# Altium project Main IF Board 5.PrjPcb
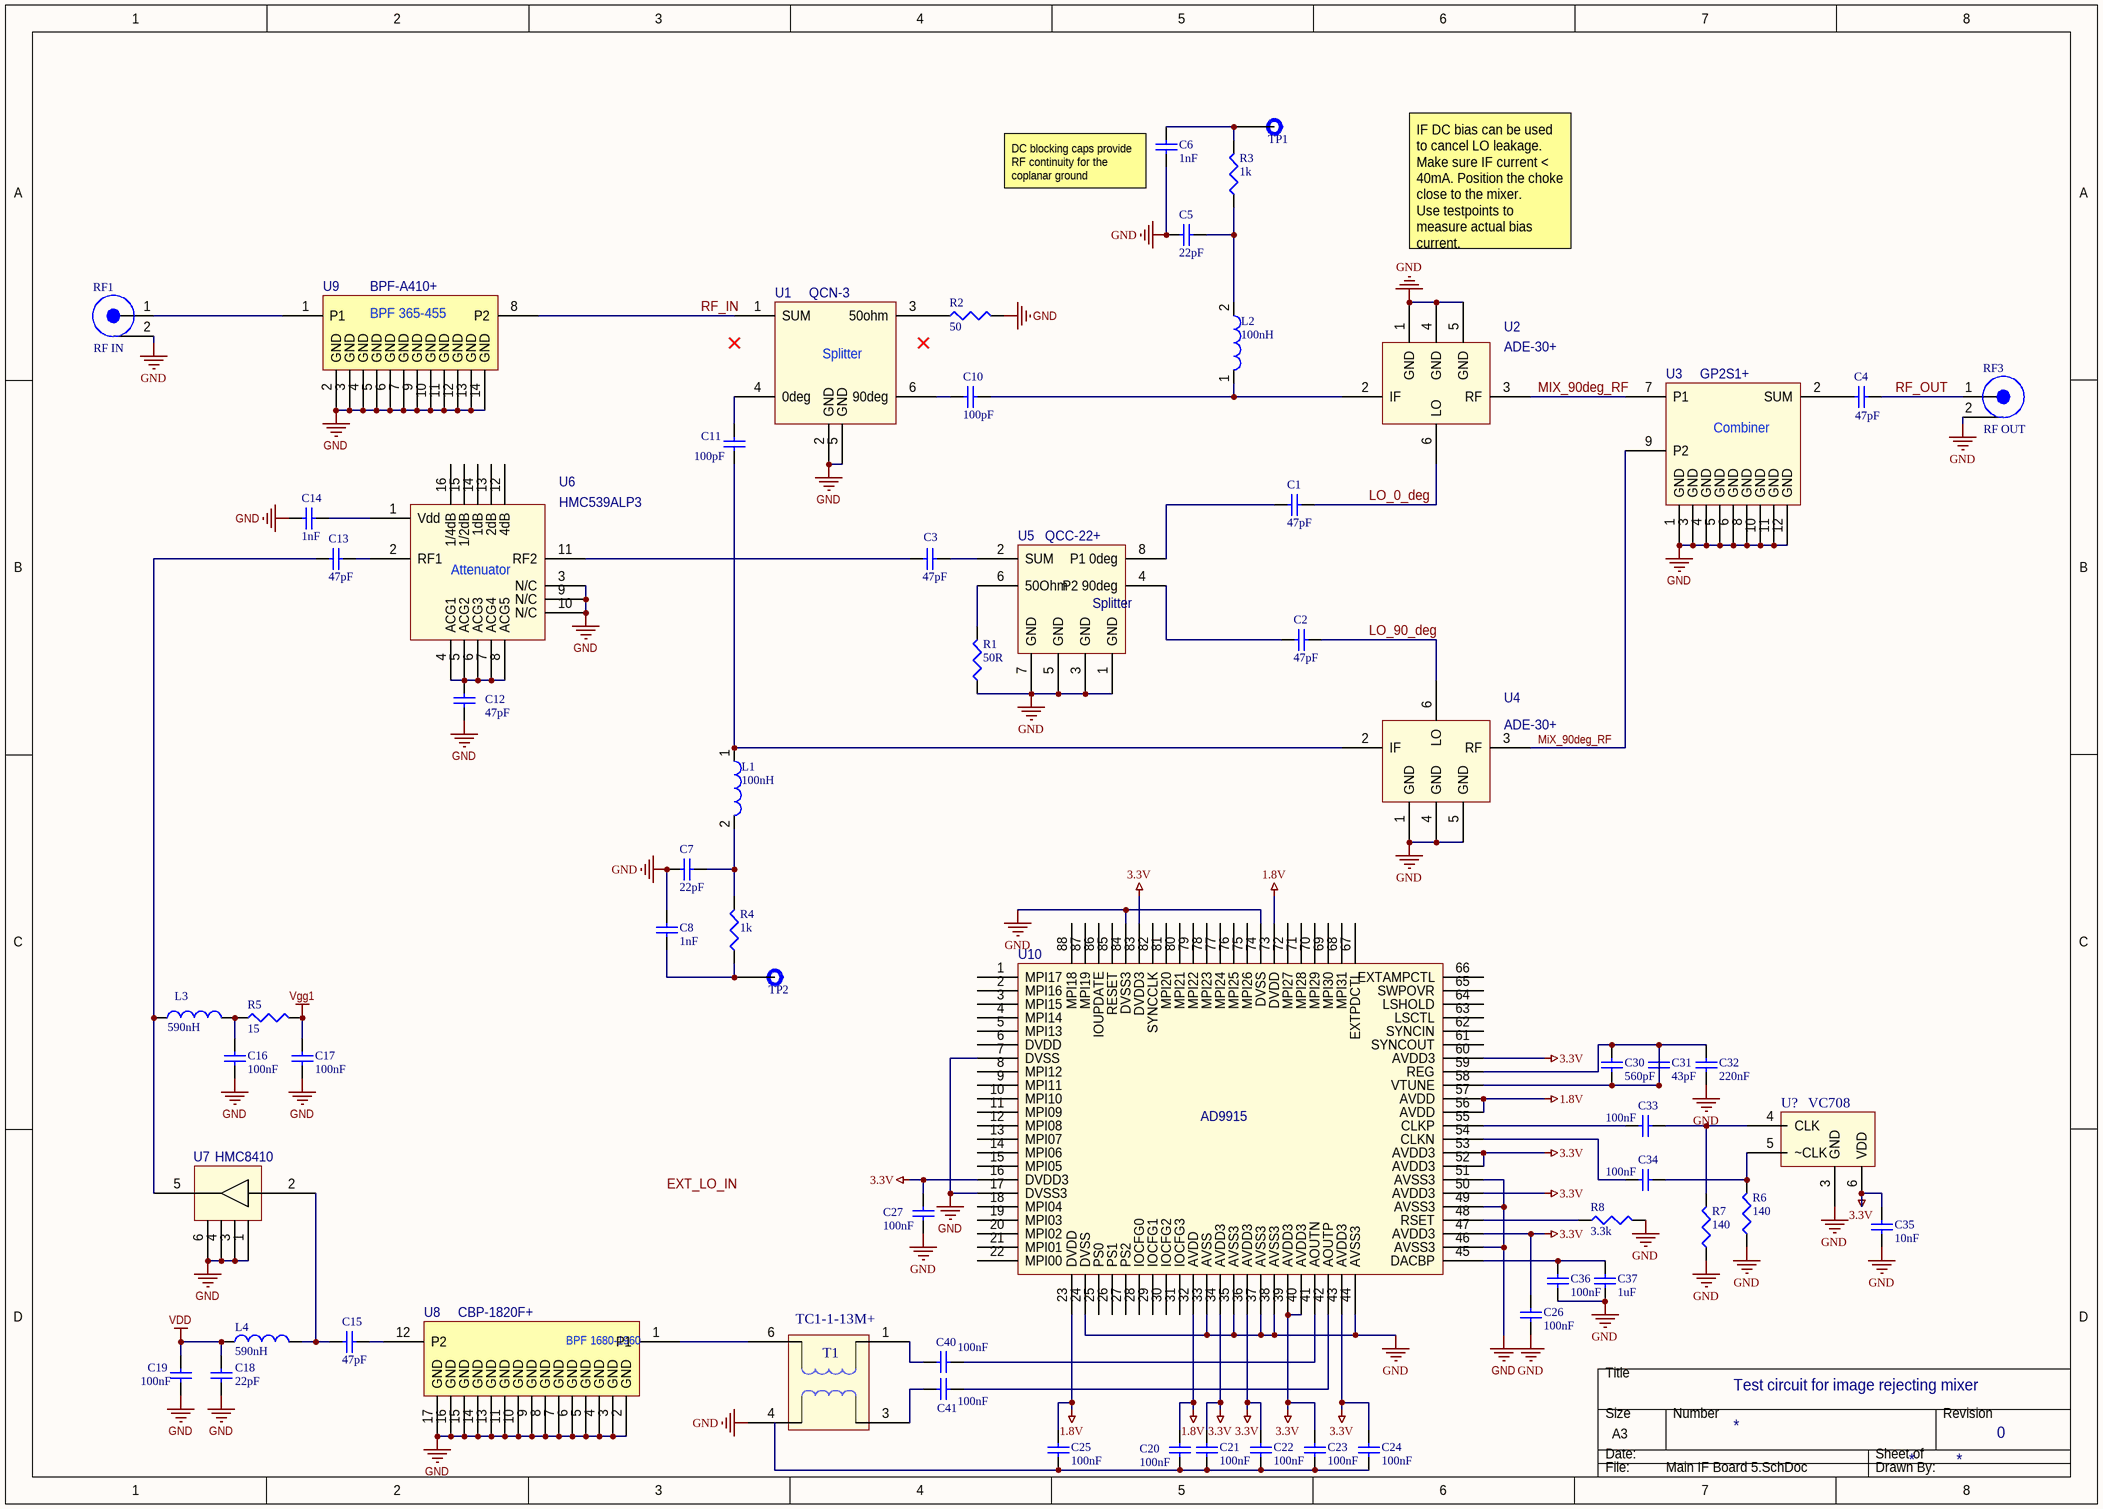
[diagram p0: Main IF Board 5.SchDoc]
1 sheet, 64 parts. Net scope: global (net labels, ports and power ports of the same name join across sheets).

## Sheet Main IF Board 5.SchDoc: Test circuit for image rejecting mixer
size A3; Revision: 0

### Parts
C1  value 47pF  [CAP0402]  (hidden comment: ATC520L103KT16T)
C2  value 47pF  [CAP0402]  (hidden comment: ATC520L103KT16T)
C3  value 47pF  [CAP0402]  (hidden comment: ATC520L103KT16T)
C4  value 47pF  [CAP0402]  (hidden comment: ATC520L103KT16T)
C5  value 22pF  [CAP0402]  (hidden comment: Capacitor)
C6  value 1nF  [CAP0603]  (hidden comment: Capacitor)
C7  value 22pF  [CAP0402]  (hidden comment: Capacitor)
C8  value 1nF  [CAP0603]  (hidden comment: Capacitor)
C10  value 100pF  [CAP0402]  (hidden comment: Capacitor)
C11  value 100pF  [CAP0402]  (hidden comment: Capacitor)
C12  value 47pF  [CAP0402]  (hidden comment: Capacitor)
C13  value 47pF  [CAP0402]  (hidden comment: Capacitor)
C14  value 1nF  [CAP0402]  (hidden comment: Capacitor)
C15  value 47pF  [CAP0402]  (hidden comment: Capacitor)
C16  value 100nF  [CAP0402]  (hidden comment: Capacitor)
C17  value 100nF  [CAP0402]  (hidden comment: Capacitor)
C18  value 22pF  [CAP0402]  (hidden comment: Capacitor)
C19  value 100nF  [CAP0603]  (hidden comment: Capacitor)
C20  value 100nF  [CAP0402]  (hidden comment: Capacitor)
C21  value 100nF  [CAP0402]  (hidden comment: Capacitor)
C22  value 100nF  [CAP0402]  (hidden comment: Capacitor)
C23  value 100nF  [CAP0402]  (hidden comment: Capacitor)
C24  value 100nF  [CAP0402]  (hidden comment: Capacitor)
C25  value 100nF  [CAP0402]  (hidden comment: Capacitor)
C26  value 100nF  [CAP0402]  (hidden comment: Capacitor)
C27  value 100nF  [CAP0402]  (hidden comment: Capacitor)
C30  value 560pF  [CAP0402]  (hidden comment: Capacitor)
C31  value 43pF  [CAP0402]  (hidden comment: Capacitor)
C32  value 220nF  [CAP0603]  (hidden comment: Capacitor)
C33  value 100nF  [CAP0402]  (hidden comment: Capacitor)
C34  value 100nF  [CAP0402]  (hidden comment: Capacitor)
C35  value 10nF  [CAP0402]  (hidden comment: Capacitor)
C36  value 100nF  [CAP0402]  (hidden comment: Capacitor)
C37  value 1uF  [CAP0603]  (hidden comment: Capacitor)
C40  value 100nF  [CAP0402]  (hidden comment: Capacitor)
C41  value 100nF  [CAP0402]  (hidden comment: Capacitor)
L1  value 100nH  [Coilcraft_BCL-122]  (hidden comment: Inductor)
L2  value 100nH  [Coilcraft_BCL-122]  (hidden comment: Inductor)
L3  value 590nH  [CAP0402]  (hidden comment: Inductor)
L4  value 590nH  [CAP0402]  (hidden comment: Inductor)
R1  value 50R  [RES0603]  (hidden comment: Resistor)
R2  value 50  [RES0603]  (hidden comment: Resistor)
R3  value 1k  [RES0603]  (hidden comment: Resistor)
R4  value 1k  [RES0603]  (hidden comment: Resistor)
R5  value 15  [RES0402]  (hidden comment: Resistor)
R6  value 140  [RES0402]  (hidden comment: Resistor)
R7  value 140  [RES0402]  (hidden comment: Resistor)
R8  value 3.3k  [RES0402]  (hidden comment: Resistor)
RF1  RF IN  [SMA_edge_launch_cutout_Cinch]
RF3  RF OUT  [SMA_edge_launch_cutout_Cinch]
T1  TC1-1-13M+
TP1  TP1  [1XHeader 100mil]  (value not drawn)
TP2  TP2  [1XHeader 100mil]  (value not drawn)
U1  QCN-3  [FV1206-1]
U2  ADE-30+  [Minicircuits_CD542]
U3  GP2S1+  [DQ1225]
U4  ADE-30+  [Minicircuits_CD542]
U5  QCC-22+  [Minicircuits_GF981]
U6  HMC539ALP3  [HMC539ALP3]
U7  HMC8410  [HMC8410]
U8  CBP-1820F+  [CBP-1820F+]
U9  BPF-A410+  [BPF-A410+]
U10  AD9915
U?  VC708

### Nets
1.8V: C20.2 C25.2 U10.23(DVDD) U10.32(AVDD) U10.56(AVDD) U10.57(AVDD) U10.73(DVDD)
3.3V: C21.2 C22.2 C23.2 C24.2 C26.2 C27.1 C35.2 U10.16(DVDD3) U10.34(AVDD3) U10.36(AVDD3) U10.39(AVDD3) U10.40(AVDD3) U10.43(AVDD3) U10.47(AVDD3) U10.50(AVDD3) U10.52(AVDD3) U10.53(AVDD3) U10.60(AVDD3) U10.83(DVDD3) U?.6(VDD)
GND: C5.1 C6.2 C7.1 C8.2 C12.1 C14.1 C16.1 C17.1 C18.1 C19.1 C26.1 C27.2 C32.1 C35.1 C36.1 C37.1 R1.1 R2.2 R6.1 R7.1 R8.2 RF1.2 RF3.2 T1.4 U1.2(GND) U1.5(GND) U2.1(GND) U2.4(GND) U2.5(GND) U3.1(GND) U3.3(GND) U3.4(GND) U3.5(GND) U3.6(GND) U3.8(GND) U3.10(GND) U3.11(GND) U3.12(GND) U4.1(GND) U4.4(GND) U4.5(GND) U5.1(GND) U5.3(GND) U5.5(GND) U5.7(GND) U6.3(N/C) U6.9(N/C) U6.10(N/C) U7.1 U7.3 U7.4 U7.6 U8.2(GND) U8.3(GND) U8.4(GND) U8.5(GND) U8.6(GND) U8.7(GND) U8.8(GND) U8.9(GND) U8.10(GND) U8.11(GND) U8.13(GND) U8.14(GND) U8.15(GND) U8.16(GND) U8.17(GND) U9.2(GND) U9.3(GND) U9.4(GND) U9.5(GND) U9.6(GND) U9.7(GND) U9.9(GND) U9.10(GND) U9.11(GND) U9.12(GND) U9.13(GND) U9.14(GND) U10.7(DVSS) U10.17(DVSS3) U10.24(DVSS) U10.33(AVSS) U10.35(AVSS3) U10.37(AVSS3) U10.38(AVSS3) U10.44(AVSS3) U10.46(AVSS3) U10.49(AVSS3) U10.51(AVSS3) U10.74(DVSS) U10.84(DVSS3) U?.3(GND)
VDD: C18.2 C19.2 L4.1
Vgg1: C17.2 R5.2
LO_0_deg: C1.1 U2.6(LO)
LO_90_deg: C2.2 U4.6(LO)
MIX_90deg_RF: U2.3(RF) U3.7(P1) U3.9(P2) U4.3(RF)
RF_IN: U1.1(SUM) U9.8(P2)
RF_OUT: C4.1 RF3.1
NetC1_2: C1.2 U5.8(P1_0deg)
NetC2_1: C2.1 U5.4(P2_90deg)
NetC3_1: C3.1 U6.11(RF2)
NetC3_2: C3.2 U5.2(SUM)
NetC4_2: C4.2 U3.2(SUM)
NetC5_2: C5.2 L2.2 R3.2
NetC6_1: C6.1 R3.1 TP1.1
NetC7_2: C7.2 L1.2 R4.2
NetC8_1: C8.1 R4.1 TP2.1
NetC10_1: C10.1 U1.6(90deg)
NetC10_2: C10.2 L2.1 U2.2(IF)
NetC11_1: C11.1 U1.4(0deg)
NetC11_2: C11.2 L1.1 U4.2(IF)
NetC12_2: C12.2 U6.4(ACG1) U6.5(ACG2) U6.6(ACG3) U6.7(ACG4) U6.8(ACG5)
NetC13_1: C13.1 L3.1 U7.5
NetC13_2: C13.2 U6.2(RF1)
NetC14_2: C14.2 U6.1(Vdd)
NetC15_1: C15.1 L4.2 U7.2
NetC15_2: C15.2 U8.12(P2)
NetC16_2: C16.2 L3.2 R5.1
NetC20_1: C20.1 C21.1 C22.1 C23.1 C24.1 C25.1
NetC30_1: C30.1 C30.2 C31.1 C31.2 C32.2 U10.58(VTUNE) U10.59(REG)
NetC33_1: C33.1 U10.55(CLKP)
NetC33_2: C33.2 R7.2 U?.4(CLK)
NetC34_1: C34.1 U10.54(CLKN)
NetC34_2: C34.2 R6.2 U?.5(~CLK)
NetC36_2: C36.2 C37.2 U10.45(DACBP)
NetC40_1: C40.1 T1.1
NetC40_2: C40.2 U10.41(AOUTN)
NetC41_1: C41.1 T1.3
NetC41_2: C41.2 U10.42(AOUTP)
NetR1_2: R1.2 U5.6(50Ohm)
NetR2_1: R2.1 U1.3(50ohm)
NetR8_1: R8.1 U10.48(RSET)
NetRF1_1: RF1.1 U9.1(P1)
NetT1_6: T1.6 U8.1(P1)

Not connected (* = marked no-connect by the designer): T1 2; U6 12(4dB) 13(2dB) 14(1dB) 15(1/2dB) 16(1/4dB); U10 1(MPI17) 2(MPI16) 3(MPI15) 4(MPI14) 5(MPI13) 6(DVDD) 8(MPI12) 9(MPI11) 10(MPI10) 11(MPI09) 12(MPI08) 13(MPI07) 14(MPI06) 15(MPI05) 18(MPI04) 19(MPI03) 20(MPI02) 21(MPI01) 22(MPI00) 25(PS0) 26(PS1) 27(PS2) 28(IOCFG0) 29(IOCFG1) 30(IOCFG2) 31(IOCFG3) 61(SYNCOUT) 62(SYNCIN) 63(LSCTL) 64(LSHOLD) 65(SWPOVR) 66(EXTAMPCTL) 67(EXTPDCTL) 68(MPI31) 69(MPI30) 70(MPI29) 71(MPI28) 72(MPI27) 75(MPI26) 76(MPI25) 77(MPI24) 78(MPI23) 79(MPI22) 80(MPI21) 81(MPI20) 82(SYNCCLK) 85(RESET) 86(IOUPDATE) 87(MPI19) 88(MPI18)

### Notes on the sheet
- (near C6) DC blocking caps provide RF continuity for the coplanar ground
- IF DC bias can be used to cancel LO leakage. Make sure IF current < 40mA. Position the choke close to the mixer.
  Use testpoints to measure actual bias current.
- Labels drawn without touching a wire or pin: EXT_LO_IN
- (in symbol BPF-A410+) BPF 365-455
- (in symbol CBP-1820F+) BPF 1680-1960
- (in symbol GP2S1+) Combiner
- (in symbol HMC539ALP3) Attenuator
- (in symbol minicircuits_QCC-22+) Splitter
- (in symbol QCN-3) Splitter

### Library data of the parts
C1-C4 = Capacitor
L3 L4 = Inductor: Model: 0402DF-591XJRU
RF1 RF3 = RF_connector: RF connector w/  pin and barrel
T1 = Trans: Published: 24-Mar-1999; LatestRevisionDate: 08-Jul-2005; LatestRevisionNote: Mech Layer 1 removed.; PackageReference: TRANS; Publisher: Altium Limited; PackageDescription: Transformer; 4 Leads
TP1 TP2 = Test point
U2 U4 = minicircuits_ADE-30+: Minicircuits mixer ADE-30+, 200MHz-3000MHz
U5 = minicircuits_QCC-22+: Mini-Circuits_ power splitter/combiner QCC-22+, 1.5-2.5GHz
U? = VC-708
C5-C8 C10-C27 C30-C37 C40 C41 = Capacitor
  C10-C27 C30-C37 C40 C41: Dielectric: *; Model: *; Voltage: *
R1-R8 = Resistor
  R2-R8: Type: *; Model: *